# EAGLE schematic logic interface (EAGLE 9.2.1)
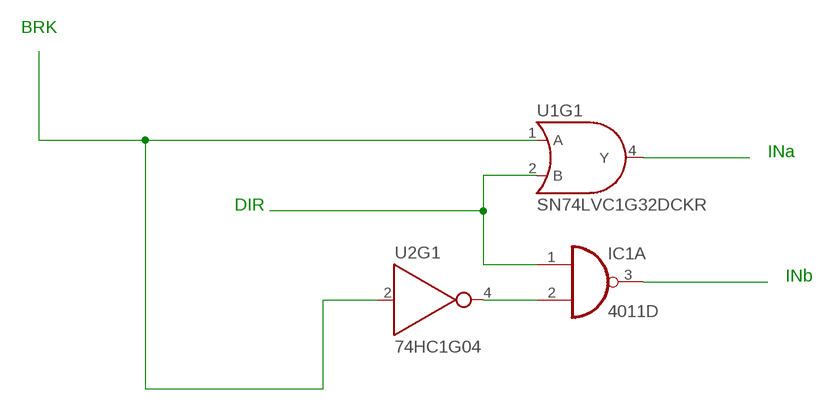
[diagram p0: schematic, sheet 1]

## Parts
IC1  4011D  [SO14]
U1  SN74LVC1G32DCKR  74LVC32DBV  [SOT23-5]
U2  74HC1G04  [SOT353]

## Nets
N$1: U1.1(A) U2.2(A)
N$2: IC1.2(A:I1) U2.4(Y)
N$3: IC1.1(A:I0) U1.2(B)
N$4: U1.4(Y)
N$5: IC1.3(A:O)
Unconnected: IC1.4(B:O) IC1.5(B:I0) IC1.6(B:I1) IC1.8(C:I0) IC1.9(C:I1) IC1.10(C:O) IC1.11(D:O) IC1.12(D:I0) IC1.13(D:I1) U1.3(P$V-) U1.5(P$V+) U2.3(P$V-) U2.5(P$V+)

## Notes on the sheet
- BRK
- INa
- DIR
- INb

## Power pins joined to a net without a drawn wire
VDD: IC1.14(P:VDD)
VSS: IC1.7(P:VSS)

## Library data of the parts
IC1 = 40xx:4011: Quad 2-input NAND
U1 = SparkFun-IC-Logic:74*32: Single OR gate IC POSITIVE-OR GATE 2-IN SC-70 SparkFun Products SparkFun Stepoko <https://www.sparkfun.com/products/13899> (ROB-13899) SparkFun LogicBlocks Kit <https://www.sparkfun.com/products/11006> (KIT-11006); PROD_ID: IC-10842
U2 = SparkFun-IC-Logic:74*1G04: Single Inverter IC NOT GATE INVERTER SNGL 1IN SOT353 Supply: 1.65V to 5.5V Datasheet <http://diodes.com/datasheets/74LVC1G04.pdf> SparkFun Products SparkFun Stepoko <https://www.sparkfun.com/products/13899> (ROB-13899) SparkFun CryptoShield <https://www.sparkfun.com/products/13183> (DEV-13183) SparkFun LogicBlocks Kit <https://www.sparkfun.com/products/11006> (KIT-11006) SparkFun ArduMoto <https://www.sparkfun.com/products/9815> (DEV-09815); PROD_ID: COMP-08268